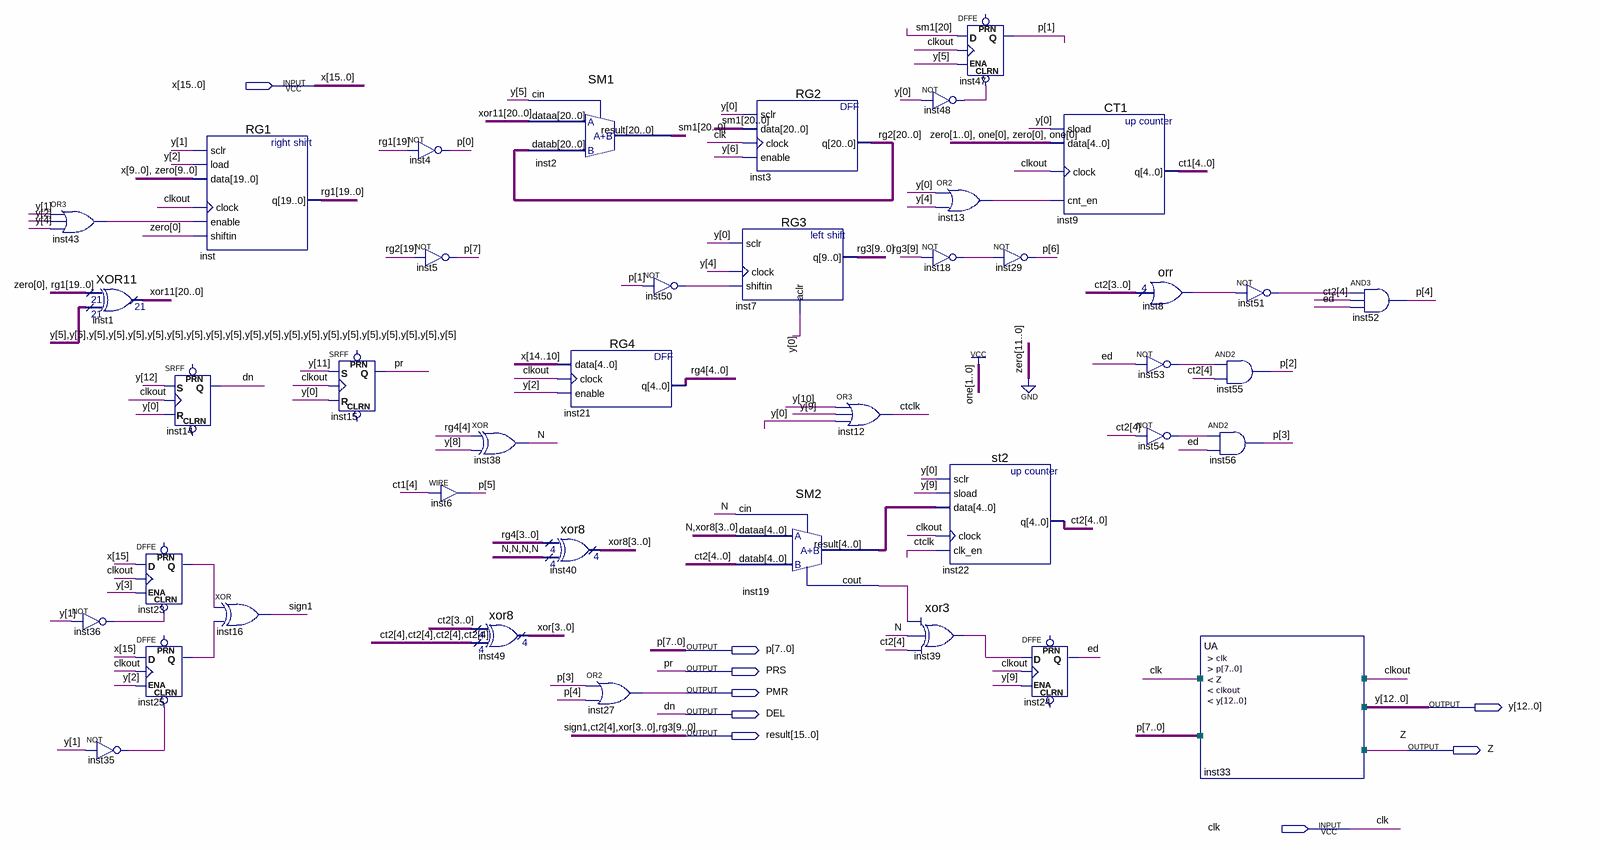
[diagram p0: schematic sheet]
// Quartus schematic delenie.bdf as structural Verilog: 41 symbols, 9 pins
module delenie (
  input  [15:0] x,
  input  clk,
  output [7:0] p,
  output PRS,
  output PMR,
  output [12:0] y,
  output DEL,
  output [15:0] result,
  output Z
);

  wire clkout, ctclk, ed, inst8_result, inst13_out, inst18_out, inst19_cout, inst23_q, inst25_q, inst35_out,
       inst36_out, inst39_result, inst43_out, inst48_out, inst50_out, inst51_out, inst53_out, inst54_out, N;
  wire [3:0] ct2, xor8;
  wire [4:0] ct1, inst19_result, rg4;
  wire [19:0] rg1;
  wire [20:0] rg2, sm1, xor11;

  or inst43 (inst43_out, y[1], y[2], y[4]);
  not inst36 (inst36_out, y[1]);
  XOR11 inst1 (.data0x({1'b0, rg1}), .data1x({21{y[5]}}), .result(xor11));
  DFFE inst23 (.CLRN(inst36_out), .D(x[15]), .CLK(clkout), .ENA(y[3]), .Q(inst23_q));  // open: PRN
  DFFE inst25 (.CLRN(inst35_out), .D(x[15]), .CLK(clkout), .ENA(y[2]), .Q(inst25_q));  // open: PRN
  not inst35 (inst35_out, y[1]);
  RG1 inst (
    .sclr(y[1]), .load(y[2]), .data({x[9:0], {10{1'b0}}}), .clock(clkout), .enable(inst43_out),
    .shiftin(1'b0), .q(rg1));
  SRFF inst14 (.S(y[12]), .R(y[0]), .CLK(clkout), .Q(DEL));  // open: PRN, CLRN
  xor inst16 (result[15], inst23_q, inst25_q);
  SRFF inst15 (.S(y[11]), .R(y[0]), .CLK(clkout), .Q(PRS));  // open: PRN, CLRN
  not inst4 (p[0], rg1[19]);
  not inst5 (p[7], rg2[19]);
  xor inst38 (N, rg4[4], y[8]);
  assign p[5] = ct1[4];  // WIRE inst6
  xor8 inst49 (.data0x(ct2), .data1x({4{result[14]}}), .result(result[13:10]));
  SM1 inst2 (.dataa(xor11), .datab(rg2), .cin(y[5]), .result(sm1));
  RG4 inst21 (.data(x[14:10]), .clock(clkout), .enable(y[2]), .q(rg4));
  xor8 inst40 (.data0x(rg4[3:0]), .data1x({4{N}}), .result(xor8));
  or inst27 (PMR, p[3], p[4]);
  not inst50 (inst50_out, p[1]);
  RG2 inst3 (.sclr(y[0]), .data(sm1), .clock(clk), .enable(y[6]), .q(rg2));
  RG3 inst7 (.sclr(y[0]), .clock(y[4]), .shiftin(inst50_out), .aclr(y[0]), .q(result[9:0]));
  SM2 inst19 (.dataa({N, xor8}), .datab({result[14], ct2}), .cin(N), .result(inst19_result), .cout(inst19_cout));
  or inst12 (ctclk, y[10], y[9], y[0]);
  not inst48 (inst48_out, y[0]);
  or inst13 (inst13_out, y[0], y[4]);
  not inst18 (inst18_out, result[9]);
  st2 inst22 (.sclr(y[0]), .sload(y[9]), .data(inst19_result), .clock(clkout), .clk_en(ctclk), .q({result[14], ct2}));
  xor3 inst39 (.data0(inst19_cout), .data1(N), .data2(result[14]), .result(inst39_result));
  DFFE inst47 (.CLRN(inst48_out), .D(sm1[20]), .CLK(clkout), .ENA(y[5]), .Q(p[1]));  // open: PRN
  not inst29 (p[6], inst18_out);
  CT1 inst9 (.sload(y[0]), .data(5'b00101), .clock(clkout), .cnt_en(inst13_out), .q(ct1));
  DFFE inst24 (.D(inst39_result), .CLK(clkout), .ENA(y[9]), .Q(ed));  // open: PRN, CLRN
  orr inst8 (.data(ct2), .result(inst8_result));
  not inst53 (inst53_out, ed);
  not inst54 (inst54_out, result[14]);
  and inst55 (p[2], inst53_out, result[14]);
  and inst56 (p[3], inst54_out, ed);
  UA inst33 (.clk(clk), .p(p), .Z(Z), .clkout(clkout), .y(y));
  not inst51 (inst51_out, inst8_result);
  and inst52 (p[4], inst51_out, result[14], ed);

  // Other names for the same wires on the sheet: ct2[4] = result[14]; dn = DEL; pr = PRS; rg3[9:0] = result[9:0];
  //   sign1 = result[15]; xor[3:0] = result[13:10]
endmodule
